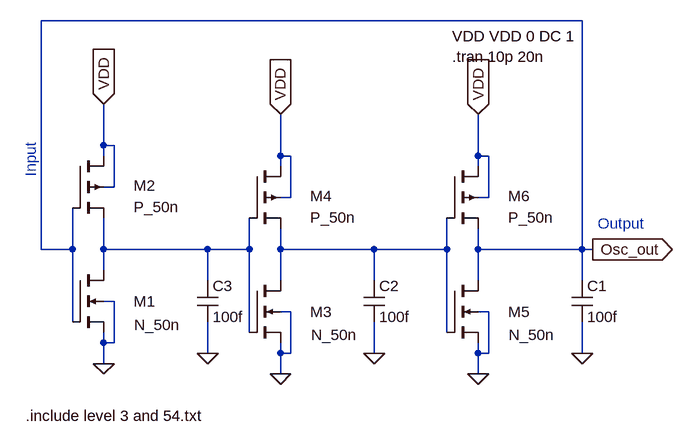
[diagram p0: schematic Ringoscillator.asc]
Ringoscillator.asc, the LTspice schematic file:
Version 4
SHEET 1 1116 680
WIRE 944 -288 112 -288
WIRE 208 -96 208 -160
WIRE 224 -96 208 -96
WIRE 208 -80 208 -96
WIRE 480 -80 480 -144
WIRE 496 -80 480 -80
WIRE 784 -80 784 -144
WIRE 800 -80 784 -80
WIRE 480 -64 480 -80
WIRE 784 -64 784 -80
WIRE 224 -32 224 -96
WIRE 224 -32 208 -32
WIRE 496 -16 496 -80
WIRE 496 -16 480 -16
WIRE 800 -16 800 -80
WIRE 800 -16 784 -16
WIRE 112 64 112 -288
WIRE 160 64 160 0
WIRE 160 64 112 64
WIRE 208 64 208 16
WIRE 368 64 208 64
WIRE 432 64 432 16
WIRE 432 64 368 64
WIRE 480 64 480 32
WIRE 624 64 480 64
WIRE 736 64 736 16
WIRE 736 64 624 64
WIRE 784 64 784 32
WIRE 944 64 944 -288
WIRE 944 64 784 64
WIRE 960 64 944 64
WIRE 208 96 208 64
WIRE 368 112 368 64
WIRE 480 112 480 64
WIRE 624 112 624 64
WIRE 784 112 784 64
WIRE 944 112 944 64
WIRE 224 144 208 144
WIRE 496 160 480 160
WIRE 800 160 784 160
WIRE 160 176 160 64
WIRE 432 192 432 64
WIRE 736 192 736 64
WIRE 208 208 208 192
WIRE 224 208 224 144
WIRE 224 208 208 208
WIRE 368 224 368 176
WIRE 480 224 480 208
WIRE 496 224 496 160
WIRE 496 224 480 224
WIRE 624 224 624 176
WIRE 784 224 784 208
WIRE 800 224 800 160
WIRE 800 224 784 224
WIRE 944 224 944 176
WIRE 208 240 208 208
WIRE 480 256 480 224
WIRE 784 256 784 224
FLAG 208 -160 VDD
IOPIN 208 -160 In
FLAG 208 240 0
FLAG 480 -144 VDD
IOPIN 480 -144 In
FLAG 480 256 0
FLAG 784 -144 VDD
IOPIN 784 -144 In
FLAG 784 256 0
FLAG 944 224 0
FLAG 960 64 Osc_out
IOPIN 960 64 Out
FLAG 368 224 0
FLAG 624 224 0
SYMBOL nmos4 160 96 R0
WINDOW 0 94 48 Left 2
WINDOW 3 95 84 Left 2
SYMATTR InstName M1
SYMATTR Value N_50n
SYMATTR Value2 l=50n w=0.5u
SYMBOL pmos4 160 -80 R0
WINDOW 0 94 46 Left 2
WINDOW 3 94 79 Left 2
SYMATTR InstName M2
SYMATTR Value P_50n
SYMATTR Value2 l=50n w=1u
SYMBOL nmos4 432 112 R0
WINDOW 0 94 48 Left 2
WINDOW 3 95 84 Left 2
SYMATTR InstName M3
SYMATTR Value N_50n
SYMATTR Value2 l=50n w=0.5u
SYMBOL pmos4 432 -64 R0
WINDOW 0 94 46 Left 2
WINDOW 3 94 79 Left 2
SYMATTR InstName M4
SYMATTR Value P_50n
SYMATTR Value2 l=50n w=1u
SYMBOL nmos4 736 112 R0
WINDOW 0 94 48 Left 2
WINDOW 3 95 84 Left 2
SYMATTR InstName M5
SYMATTR Value N_50n
SYMATTR Value2 l=50n w=0.5u
SYMBOL pmos4 736 -64 R0
WINDOW 0 94 46 Left 2
WINDOW 3 94 79 Left 2
SYMATTR InstName M6
SYMATTR Value P_50n
SYMATTR Value2 l=50n w=1u
SYMBOL cap 928 112 R0
SYMATTR InstName C1
SYMATTR Value 100f
SYMBOL cap 608 112 R0
SYMATTR InstName C2
SYMATTR Value 100f
SYMBOL cap 352 112 R0
SYMATTR InstName C3
SYMATTR Value 100f
TEXT 744 -264 Left 2 !VDD VDD 0 DC 1\n.tran 10p 20n
TEXT 88 320 Left 2 !.include level 3 and 54.txt
TEXT 96 -48 VLeft 2 ;Input
TEXT 968 24 Left 2 ;Output

The netlist it stands for:
* Ringoscillator.asc
M1 N001 Osc_out 0 0 N_50n l=50n w=0.5u
M2 VDD Osc_out N001 VDD P_50n l=50n w=1u
M3 N002 N001 0 0 N_50n l=50n w=0.5u
M4 VDD N001 N002 VDD P_50n l=50n w=1u
M5 Osc_out N002 0 0 N_50n l=50n w=0.5u
M6 VDD N002 Osc_out VDD P_50n l=50n w=1u
C1 Osc_out 0 100f
C2 N002 0 100f
C3 N001 0 100f
.model NMOS NMOS
.model PMOS PMOS
.lib standard.mos
VDD VDD 0 DC 1
.tran 10p 20n
.include level 3 and 54.txt
* Input
* Output
.backanno
.end